# EAGLE design isp_abschluss (EAGLE 5.04)
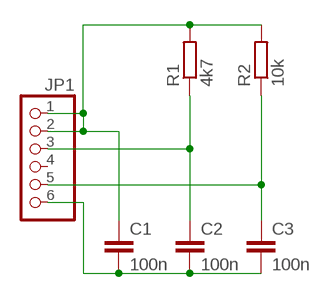
[diagram p0: schematic, sheet 1]

## Parts
C1  100n  C-EU050-024X044  [C050-024X044]
C2  100n  C-EU050-024X044  [C050-024X044]
C3  100n  C-EU050-024X044  [C050-024X044]
JP1  PINHD-1X6  [1X06]
R1  4k7  R-EU_0207/7  [0207/7]
R2  10k  R-EU_0207/7  [0207/7]

## Nets
GND: C1.2 C2.2 C3.2 JP1.6
RESET: C2.1 JP1.3 R1.1
RXD: C3.1 JP1.5 R2.1
VCC: C1.1 JP1.1 JP1.2 R1.2 R2.2
Unconnected: JP1.4

## Library data of the parts
C1-C3 = rcl:C-EU: CAPACITOR, European symbol
JP1 = pinhead:PINHD-1X6: PIN HEADER
R1 R2 = rcl:R-EU_: RESISTOR, European symbol

## Board
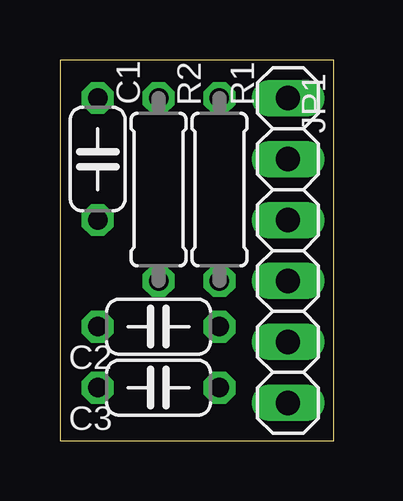
[diagram p1: board, top side]
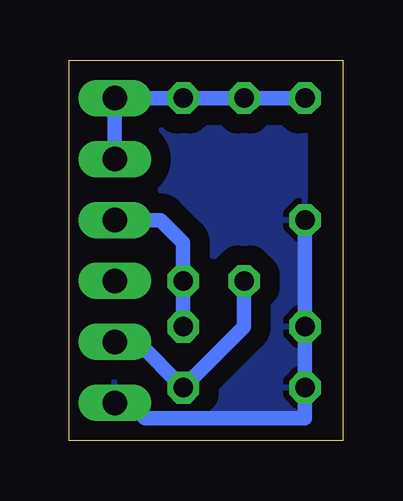
[diagram p2: board, bottom side, seen from below]

Size 11.42 x 15.87 mm. Coordinates in mm from the lower left corner, seen from the top.
Outline: 11.42,15.87 0,15.87 0,0 11.42,0 11.42,15.87
Copper layers (1*16): Top 0.035mm / dielectric 1.5mm / Bottom 0.035mm
Design rules "default": minimum track width 10mil, minimum drill 24mil, track to track 8mil, track to pad 8mil, pad to pad 8mil, via to via 8mil, smd to smd 8mil, copper to edge 40mil, drill to drill 8mil, minimum pad ring 10mil, minimum via ring 8mil, stop-mask expansion 4mil, vias tented up to drill 0mil, thermal gap 10mil

### Footprints (pad centres in the part's own frame; a part is rotated, then mirrored left to right if it is on the bottom)
C050-024X044 = drill 0.813 octagon: 1 -2.54,0; 2 2.54,0
1X06 = drill 1.016 long: 1 -6.35,0; 2 -3.81,0; 3 -1.27,0; 4 1.27,0; 5 3.81,0; 6 6.35,0
0207/7 = drill 0.813 octagon: 1 -3.81,0; 2 3.81,0

### Placement (x,y rotation side)
C1  1.57,11.74 270 top
C2  4.12,4.75 180 top
C3  4.12,2.21 180 top
JP1  9.51,7.93 270 top
R1  6.66,10.47 90 top
R2  4.12,10.47 90 top

### Tracks (layer width: path | path; a pad name or v marks a point on that pad's centre or on a via)
GND
  Bottom 0.61: JP1.6 8.88,1.58 8.24,0.94 1.57,0.94 C3.2 C2.2 C1.2
  pour Bottom (isolate 0.813): 9.83,0.31 9.83,15.55 1.57,15.55 1.57,0.31
RESET
  Bottom 0.61: C2.1 R1.1 6.66,8.25 7.61,9.2 JP1.3
RXD
  Bottom 0.61: JP1.5 8.56,4.12 C3.1 4.12,4.75 R2.1
VCC
  Bottom 0.61: JP1.2 JP1.1 R1.2 R2.2 C1.1